# Altium schematic sheet Power.SchDoc
size 406 x 304 mm; SheetNumber: 2; SheetTotal: 6
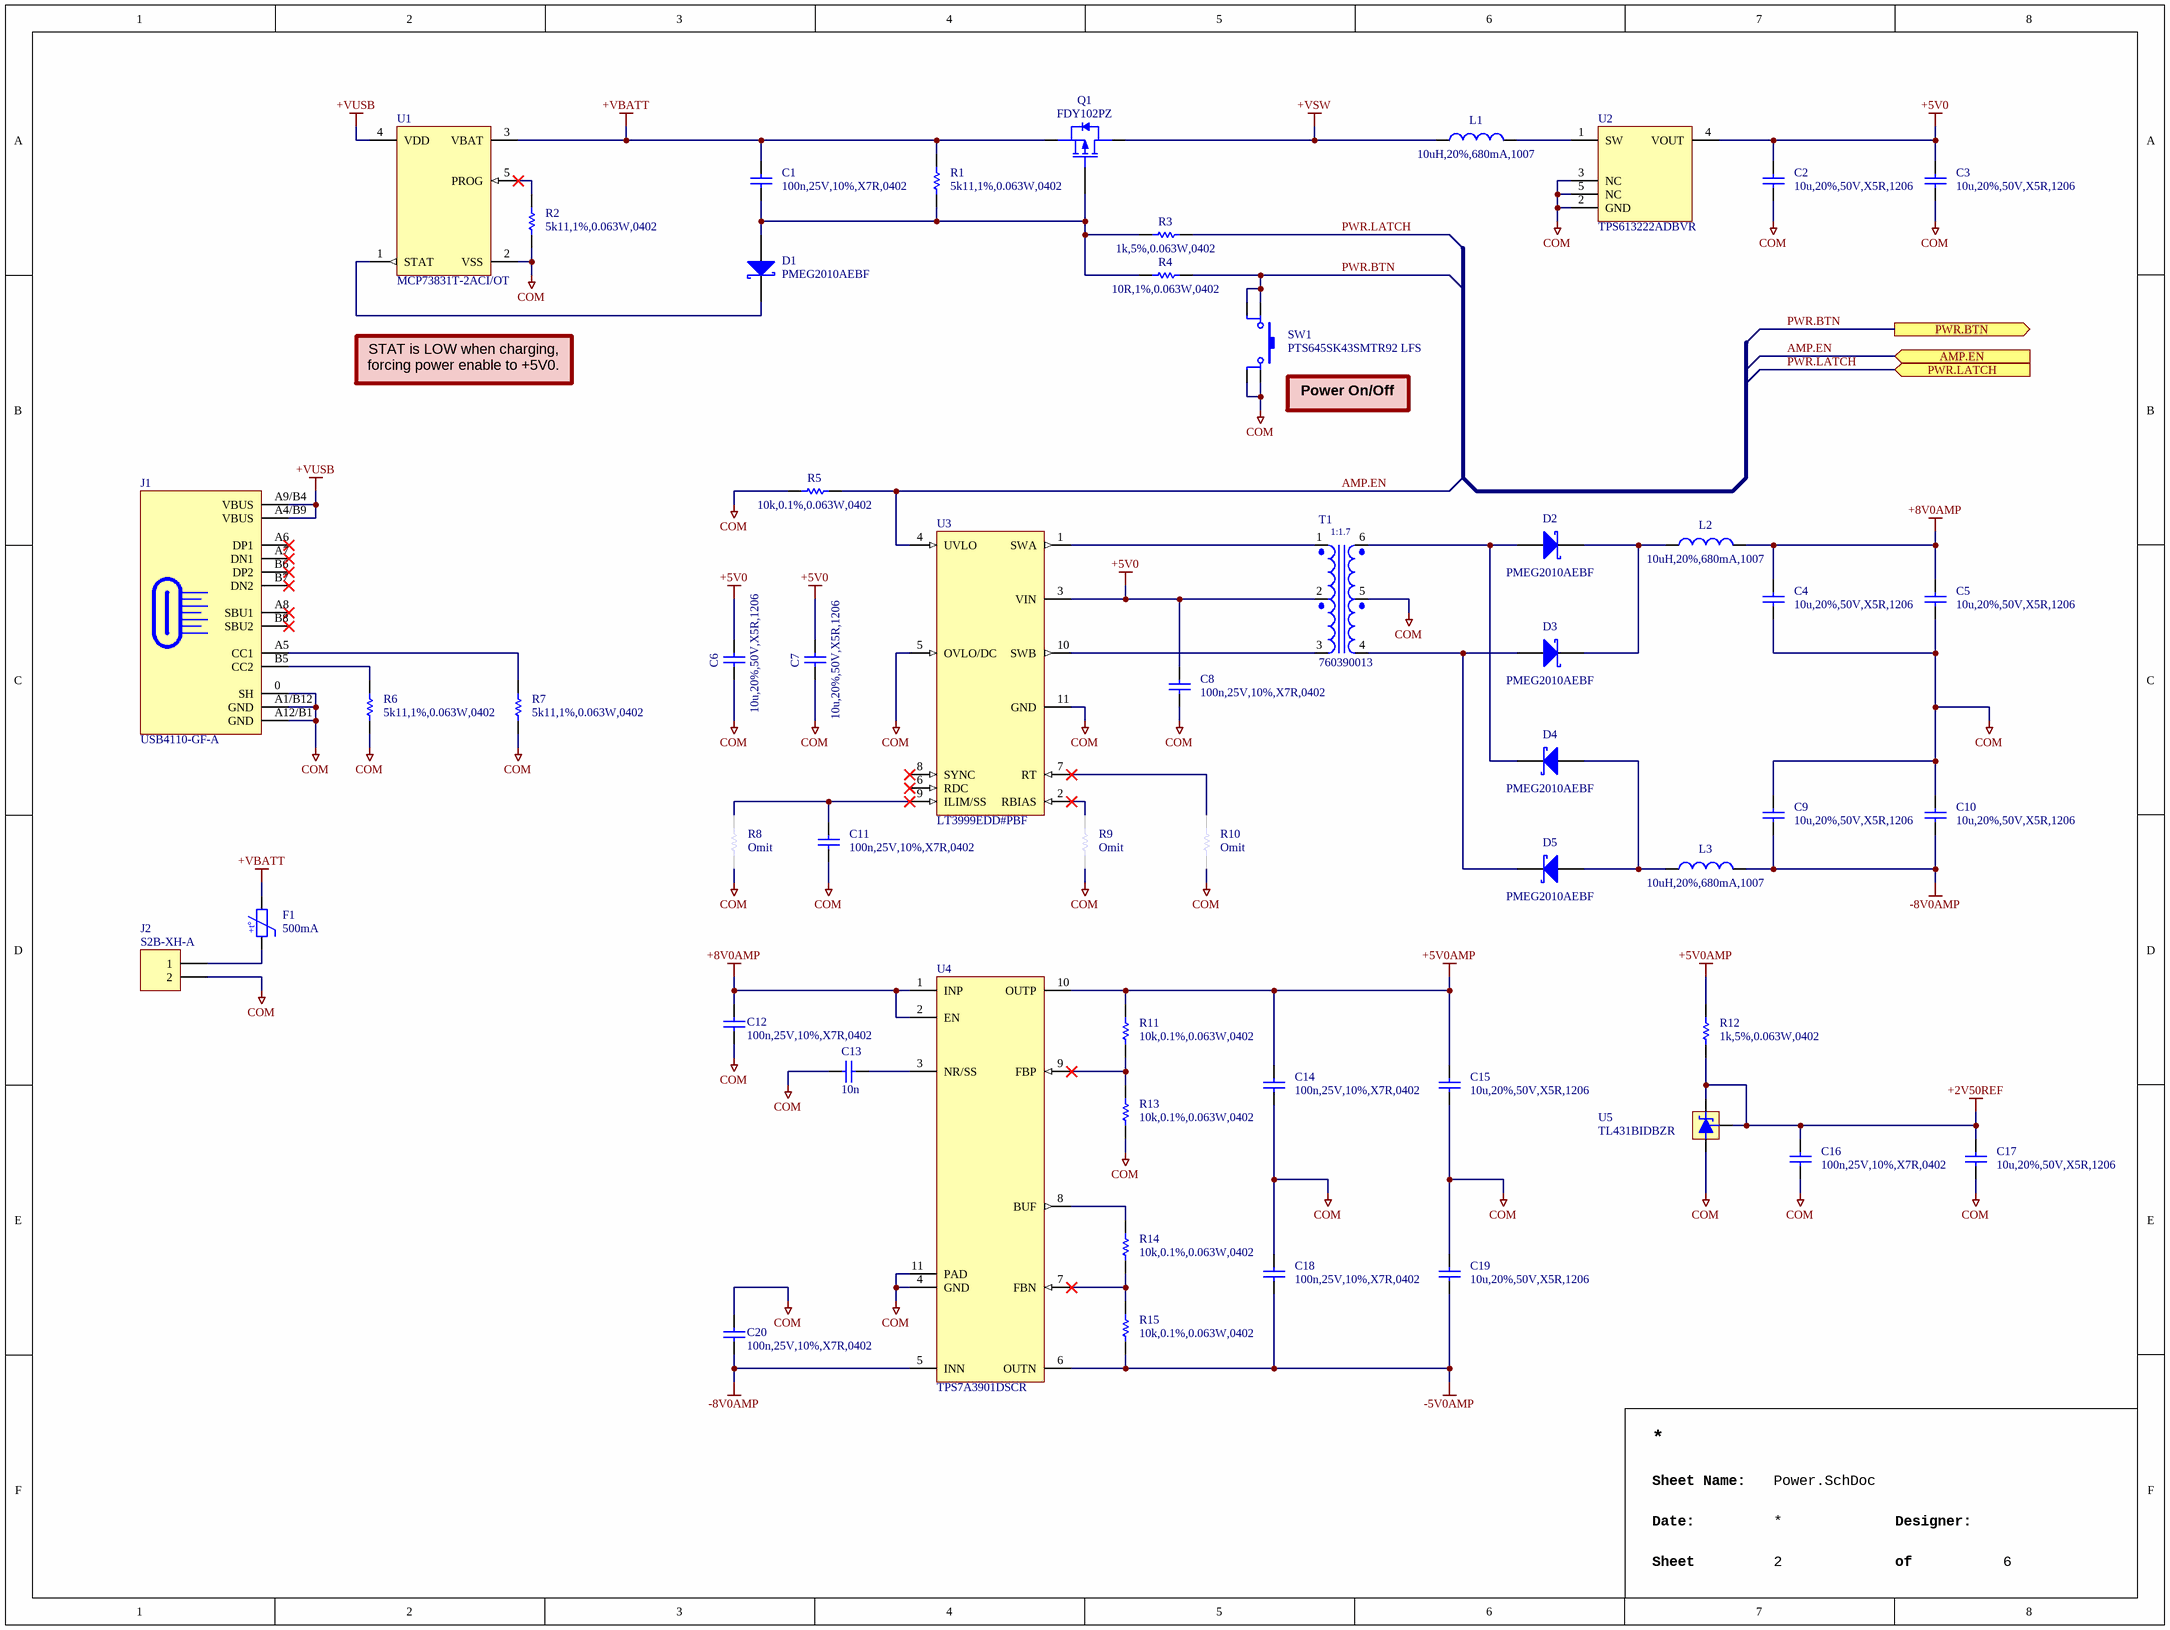
[diagram p0: Power.SchDoc]

## Parts
C1  100n,25V,10%,X7R,0402  [CAPC1005X06N]
C2  10u,20%,50V,X5R,1206  [CAPC3216X16N]
C3  10u,20%,50V,X5R,1206  [CAPC3216X16N]
C4  10u,20%,50V,X5R,1206  [CAPC3216X16N]
C5  10u,20%,50V,X5R,1206  [CAPC3216X16N]
C6  10u,20%,50V,X5R,1206  [CAPC3216X16N]
C7  10u,20%,50V,X5R,1206  [CAPC3216X16N]
C8  100n,25V,10%,X7R,0402  [CAPC1005X06N]
C9  10u,20%,50V,X5R,1206  [CAPC3216X16N]
C10  10u,20%,50V,X5R,1206  [CAPC3216X16N]
C11  100n,25V,10%,X7R,0402  [CAPC1005X06N]
C12  100n,25V,10%,X7R,0402  [CAPC1005X06N]
C13  10n  [CAPC1005X06N]
C14  100n,25V,10%,X7R,0402  [CAPC1005X06N]
C15  10u,20%,50V,X5R,1206  [CAPC3216X16N]
C16  100n,25V,10%,X7R,0402  [CAPC1005X06N]
C17  10u,20%,50V,X5R,1206  [CAPC3216X16N]
C18  100n,25V,10%,X7R,0402  [CAPC1005X06N]
C19  10u,20%,50V,X5R,1206  [CAPC3216X16N]
C20  100n,25V,10%,X7R,0402  [CAPC1005X06N]
D1  PMEG2010AEBF  [NEXPERIA_PKG_SOD523]
D2  PMEG2010AEBF  [NEXPERIA_PKG_SOD523]
D3  PMEG2010AEBF  [NEXPERIA_PKG_SOD523]
D4  PMEG2010AEBF  [NEXPERIA_PKG_SOD523]
D5  PMEG2010AEBF  [NEXPERIA_PKG_SOD523]
F1  500mA  [BELFUSE_CHIP1812]
J1  USB4110-GF-A  [GCT_USB4110-GF-A]
J2  S2B-XH-A  [JST_S2B-XH-A]
L1  10uH,20%,680mA,1007  [TAIYO-YUDEN_LSQPA251818T100M]
L2  10uH,20%,680mA,1007  [TAIYO-YUDEN_LSQPA251818T100M]
L3  10uH,20%,680mA,1007  [TAIYO-YUDEN_LSQPA251818T100M]
Q1  FDY102PZ  [ONSEMI_SC-89]
R1  5k11,1%,0.063W,0402  [RESC1005X04N]
R2  5k11,1%,0.063W,0402  [RESC1005X04N]
R3  1k,5%,0.063W,0402  [RESC1005X04N]
R4  10R,1%,0.063W,0402  [RESC1005X04N]
R5  10k,0.1%,0.063W,0402  [RESC1005X04N]
R6  5k11,1%,0.063W,0402  [RESC1005X04N]
R7  5k11,1%,0.063W,0402  [RESC1005X04N]
R8  Omit  [RESC1005X04N]  (no BOM)
R9  Omit  [RESC1005X04N]  (no BOM)
R10  Omit  [RESC1005X04N]  (no BOM)
R11  10k,0.1%,0.063W,0402  [RESC1005X04N]
R12  1k,5%,0.063W,0402  [RESC1005X04N]
R13  10k,0.1%,0.063W,0402  [RESC1005X04N]
R14  10k,0.1%,0.063W,0402  [RESC1005X04N]
R15  10k,0.1%,0.063W,0402  [RESC1005X04N]
SW1  PTS645SK43SMTR92 LFS  [C&K_PTS645SK43SMTR92 LFS]
T1  760390013  [WURTH_760390013]
U1  MCP73831T-2ACI/OT  [MICROCHIP_PKG_SOT23(C04-2091-OT)]
U2  TPS613222ADBVR  [TEXASINSTRUMENTS_PKG_DBV0005A]
U3  LT3999EDD#PBF  [ANALOGDEVICES_PKG_DD]
U4  TPS7A3901DSCR  [TEXASINSTRUMENTS_PKG_DSC0010J]
U5  TL431BIDBZR  [SOT95P240X120-3N]

## Ports
AMP.EN (in), PWR.BTN (out), PWR.LATCH (in)

## Nets
+2V50REF: C16.2 C17.2 R12.1 U5.1 U5.2
+5V0: C2.2 C3.2 C6.2 C7.2 C8.2 T1.2(PCT) U2.4(VOUT) U3.3(VIN)
+5V0AMP: C14.2 C15.2 R11.2 R12.2 U4.10(OUTP)
+8V0AMP: C4.2 C5.2 C12.2 L2.2 U4.1(INP) U4.2(EN)
+VBATT: C1.2 F1.2 Q1.2(S) R1.2 U1.3(VBAT)
+VSW: L1.1 Q1.3(D)
+VUSB: J1.A4/B9(VBUS) J1.A9/B4(VBUS) U1.4(VDD)
-5V0AMP: C18.1 C19.1 R15.1 U4.6(OUTN)
-8V0AMP: C9.1 C10.1 C20.1 L3.2 U4.5(INN)
COM: C2.1 C3.1 C4.1 C5.1 C6.1 C7.1 C8.1 C9.2 C10.2 C11.1 C12.1 C13.2 C14.1 C15.1 C16.1 C17.1 C18.2 C19.2 C20.2 J1.0(SH) J1.A1/B12(GND) J1.A12/B1(GND) J2.2 R2.1 R5.1 R6.1 R7.1 R8.1 R9.1 R10.1 R13.1 SW1.3 SW1.4 T1.5(SCT) U1.2(VSS) U2.2(GND) U2.3(NC) U2.5(NC) U3.5(OVLO/DC) U3.11(GND) U4.4(GND) U4.11(PAD) U5.3
AMP.EN: R5.2 U3.4(UVLO) ; port AMP.EN
PWR.BTN: R4.2 SW1.1 SW1.2 ; port PWR.BTN
PWR.LATCH: R3.1 ; port PWR.LATCH
NetC1_1: C1.1 D1.2(A) Q1.1(G) R1.1 R3.2 R4.1
NetC11_2: C11.2 R8.2 U3.9(ILIM/SS)
NetC13_1: C13.1 U4.3(NR/SS)
NetD1_1: D1.1(K) U1.1(STAT)
NetD2_1: D2.1(K) D3.1(K) L2.1
NetD2_2: D2.2(A) D4.1(K) T1.6(S+)
NetD3_2: D3.2(A) D5.1(K) T1.4(S-)
NetD4_2: D4.2(A) D5.2(A) L3.1
NetF1_1: F1.1 J2.1
NetJ1_A5: J1.A5(CC1) R7.2
NetJ1_B5: J1.B5(CC2) R6.2
NetL1_2: L1.2 U2.1(SW)
NetR2_2: R2.2 U1.5(PROG)
NetR9_2: R9.2 U3.2(RBIAS)
NetR10_2: R10.2 U3.7(RT)
NetR11_1: R11.1 R13.2 U4.9(FBP)
NetR14_1: R14.1 R15.2 U4.7(FBN)
NetR14_2: R14.2 U4.8(BUF)
NetT1_1: T1.1(P+) U3.1(SWA)
NetT1_3: T1.3(P-) U3.10(SWB)

Not connected (* = marked no-connect by the designer): J1 A6(DP1)* A7(DN1)* A8(SBU1)* B6(DP2)* B7(DN2)* B8(SBU2)*; U3 6(RDC)* 8(SYNC)*

## Notes on the sheet
- STAT is LOW when charging, forcing power enable to +5V0.
- (near SW1) Power On/Off
- Sheet Name:
- Date:
- Sheet
- Designer:
- of
- (in symbol PTC,30V,500mA,1812) +t°
- (in symbol XFR,1-1.7,Lp=475uH,760390013) 1:1.7

## Library data of the parts
C1 C8 C11 C12 C14 C16 C18 C20 = CAP,Cer,100nF,10%,25VDC,X7R,0402: 0.1ï¿½F ï¿½10% 25V Ceramic Capacitor X7R 0402 (1005 Metric); Manufacturer 1: Murata Electronics; Manufacturer 1 Part Number: GRM155R71E104KE14J; Vendor 1 Part Number: 490-14603-1-ND; Vendor 1: DigiKey; Value: 100nF; Part Name: CAP,Cer,100nF,10%,25VDC,X7R,0402; CreatedBy: Judd Foster; HelpURL: https://search.murata.co.jp/Ceramy/image/img/A01X/G101/ENG/GRM155R71E104KE14-01.pdf
C2-C7 C9 C10 C15 C17 C19 = CAP,Cer,10uF,50VDC,X5R,1206: 10ï¿½F ï¿½20% 50V Ceramic Capacitor X5R 1206 (3216 Metric); Manufacturer 1: Samsung Electro-Mechanics; Manufacturer 1 Part Number: CL31A106MBHNNNE; Vendor 1 Part Number: 1276-6736-1-ND; Vendor 1: Digikey; Part Name: CAP,Cer,10uF,50VDC,X5R,1206; CreatedBy: Judd Foster; HelpURL: https://www.samsungsem.com/resources/file/global/support/product_catalog/MLCC.pdf; Value: 10u
C13 = CAP,Cer,10nF,25VDC,X7R,0402: 10000pF ï¿½10% 25V Ceramic Capacitor X7R 0402 (1005 Metric); Manufacturer 1: Murata Electronics; Manufacturer 1 Part Number: GCM155R71E103KA37D; Vendor 1 Part Number: 490-6043-1-ND; Vendor 1: Digikey; Part Name: CAP,Cer,10nF,25VDC,X7R,0402; CreatedBy: Judd Foster; HelpURL: https://psearch.en.murata.com/capacitor/product/GCM155R71E103KA37%23.pdf; Value: 10n
D1-D5 = DIODE,Schottky,20V,1A,SOD523: Diode 20 V 1A Surface Mount SOD-523; Manufacturer 1: Nexperia USA Inc.; Vendor 1 Part Number: 1727-8539-1-ND; Vendor 1: DigiKey; Part Name: DIODE,Schottky,20V,1A,SOD523; CreatedBy: Judd Foster; HelpURL: https://assets.nexperia.com/documents/data-sheet/PMEG2010AEB.pdf; Manufacturer 1 Part Number: PMEG2010AEBF
F1 = PTC,30V,500mA,1812: Polymeric PTC Resettable Fuse 30V 500 mA Ih Surface Mount 1812 (4532 Metric), Concave; Manufacturer 1: Bel Fuse Inc.; Manufacturer 1 Part Number: 0ZCG0050AF2C; Vendor 1 Part Number: 507-1762-1-ND; Vendor 1: Digikey; Part Name: PTC,30V,500mA,1812; CreatedBy: Judd Foster; HelpURL: https://www.belfuse.com/resources/datasheets/circuitprotection/ds-cp-0zcg-series.pdf; Value: 500mA
J1 = Conn,USB_C,SMD: USB-C (USB TYPE-C) USB 2.0 Receptacle Connector 24 (16+8 Dummy) Position Surface Mount, Right Angle; Manufacturer 1: GCT; Vendor 1 Part Number: 2073-USB4110-GF-A-1-ND; Vendor 1: Digikey; Part Name: Conn,USB_C,SMD; CreatedBy: Judd Foster; HelpURL: https://gct.co/files/drawings/usb4110.pdf; Manufacturer 1 Part Number: USB4110-GF-A
J2 = Conn,JST,2Pin,2.5mm,RA,Thru: Connector Header Through Hole, Right Angle 2 position 0.098" (2.50mm); Manufacturer 1: JST Sales America Inc.; Vendor 1 Part Number: 455-S2B-XH-A-ND; Vendor 1: DigiKey; Part Name: Conn,JST,2Pin,2.5mm,RA,Thru; CreatedBy: Judd Foster; HelpURL: https://www.jst-mfg.com/product/pdf/eng/eXH.pdf; Manufacturer 1 Part Number: S2B-XH-A
L1-L3 = IND,10uH,680mA,Wirewound,1007: 10 ÂµH Unshielded Wirewound Inductor 680 mA 468mOhm Max 1007 (2518 Metric); Manufacturer 1: Taiyo Yuden; Manufacturer 1 Part Number: LSQPA251818T100M; Vendor 1 Part Number: 587-LSQPA251818T100MCT-ND; Vendor 1: Digikey; Part Name: IND,10uH,680mA,Wirewound,1007; CreatedBy: Judd Foster; HelpURL: https://mm.digikey.com/Volume0/opasdata/d220001/medias/docus/6025/LSQPA251818T100M_SS.pdf; Value: 10uH
Q1 = MOSFET,P Ch,20V,830mA: P-Channel 20 V 830mA (Ta) 625mW (Ta) Surface Mount SC-89-3; Manufacturer 1: onsemi; Vendor 1 Part Number: FDY102PZCT-ND; Vendor 1: Digikey; Part Name: MOSFET,P Ch,20V,830mA; CreatedBy: Judd Foster; HelpURL: https://rocelec.widen.net/view/pdf/hh954mlmw6/FAIR-S-A0000083184-1.pdf?t.download=true&u=5oefqw; Manufacturer 1 Part Number: FDY102PZ
R1 R2 R6 R7 = RES,5k11,1%,0.063W,0402: 5.11 kOhms ï¿½1% 0.063W, 1/16W Chip Resistor 0402 (1005 Metric) Automotive AEC-Q200, Moisture Resistant Thick Film; Manufacturer 1: Yageo; Manufacturer 1 Part Number: AC0402FR-075K11L; Vendor 1 Part Number: 13-AC0402FR-075K11LCT-ND; Vendor 1: Digikey; Part Name: RES,5k11,1%,0.063W,0402; CreatedBy: Judd Foster; HelpURL: https://www.yageo.com/upload/media/product/productsearch/datasheet/rchip/PYu-AC_51_RoHS_L_7.pdf; Value: 5k11
R3 R12 = RES,1k,5%,0.063W,0402: 1 kOhms ï¿½5% 0.063W, 1/16W Chip Resistor 0402 (1005 Metric) Automotive AEC-Q200 Thick Film; Manufacturer 1: Stackpole Electronics Inc; Manufacturer 1 Part Number: RMCF0402JT1K00; Vendor 1 Part Number: RMCF0402JT1K00CT-ND; Vendor 1: DIgikey; Part Name: RES,1k,5%,0.063W,0402; CreatedBy: Judd Foster; HelpURL: https://www.seielect.com/catalog/sei-rmcf_rmcp.pdf; Value: 1k
R4 = RES,10R,1%,0.063W,0402: 10 Ohms ï¿½1% 0.063W, 1/16W Chip Resistor 0402 (1005 Metric) Automotive AEC-Q200 Thick Film; Manufacturer 1: Panasonic Electronic Components; Manufacturer 1 Part Number: ERJ-2RKF10R0X; Vendor 1 Part Number: P10.0LCT-ND; Vendor 1: Digikey; Part Name: RES,10R,1%,0.063W,0402; CreatedBy: Judd Foster; HelpURL: https://industrial.panasonic.com/cdbs/www-data/pdf/RDA0000/AOA0000C304.pdf; Value: 10R
R5 R11 R13-R15 = RES,10k,0.1%,0.063W,0402: 10 kOhms ï¿½0.1% 0.1W, 1/10W Chip Resistor 0402 (1005 Metric) Automotive AEC-Q200 Thin Film; Manufacturer 1: Stackpole Electronics Inc; Manufacturer 1 Part Number: RNCF0402BTE10K0; Vendor 1 Part Number: RNCF0402BTE10K0CT-ND; Vendor 1: Digikey; Part Name: RES,10k,0.1%,0.063W,0402; CreatedBy: Judd Foster; HelpURL: https://www.seielect.com/catalog/sei-rncf.pdf; Value: 10k
R8-R10 = RES,Omit,0402: Part Name: RES,Omit,0402; CreatedBy: Judd Foster; HelpURL: N/A; Manufacturer 1: N/A; Manufacturer 1 Part Number: N/A; Vendor 1: N/A; Vendor 1 Part Number: N/A; Value: Omit
SW1 = Switch,Tactile,SPST-NO,SMD,H4.3: Tactile Switch SPST-NO Top Actuated Surface Mount; Manufacturer 1: C&K; Vendor 1 Part Number: CKN9084CT-ND; Vendor 1: Digikey; Part Name: Switch,Tactile,SPST-NO,SMD,H4.3; CreatedBy: Judd Foster; HelpURL: https://www.ckswitches.com/media/1471/pts645.pdf; Manufacturer 1 Part Number: PTS645SK43SMTR92 LFS
T1 = XFR,1-1.7,Lp=475uH,760390013: Forward, Push-Pull Converters For For DC/DC Converters SMPS Transformer 3125Vrms Isolation 10kHz Surface Mount; Manufacturer 1: WÃ¼rth Elektronik; Vendor 1 Part Number: 732-4457-1-ND; Vendor 1: DigiKey; Part Name: XFR,1-1.7,Lp=475uH,760390013; CreatedBy: Judd Foster; HelpURL: https://www.we-online.com/components/products/datasheet/760390013.pdf; Manufacturer 1 Part Number: 760390013
U1 = MCP73831T-2ACI_OT: Charger IC Lithium Ion/Polymer SOT-23-5; Manufacturer 1: Microchip Technology; Vendor 1 Part Number: MCP73831T-2ACI/OTCT-ND; Vendor 1: DigiKey; Part Name: MCP73831T-2ACI_OT; CreatedBy: Judd Foster; HelpURL: https://ww1.microchip.com/downloads/en/DeviceDoc/MCP73831-Family-Data-Sheet-DS20001984H.pdf; Manufacturer 1 Part Number: MCP73831T-2ACI/OT
U2 = TPS613222ADBVR: Boost Switching Regulator IC Positive Fixed 5V 1 Output 2.5A (Switch) SC-74A, SOT-753; Manufacturer 1: Texas Instruments; Vendor 1 Part Number: 296-50503-1-ND; Vendor 1: DigiKey; Part Name: TPS613222ADBVR; CreatedBy: Judd Foster; HelpURL: https://www.ti.com/lit/ds/symlink/tps61322.pdf?HQS=dis-dk-null-digikeymode-dsf-pf-null-wwe&ts=1737253084273; Manufacturer 1 Part Number: TPS613222ADBVR
U3 = LT3999EDD#PBF: Push-Pull Switching Regulator IC Positive, Isolation Capable Adjustable 1 Output 1A 10-WFDFN Exposed Pad; Manufacturer 1: Analog Devices Inc.; Vendor 1 Part Number: 505-LT3999EDD#PBF-ND; Vendor 1: DigiKey; Part Name: LT3999EDD#PBF; CreatedBy: Judd Foster; HelpURL: https://www.analog.com/media/en/technical-documentation/data-sheets/3999fa.pdf; Manufacturer 1 Part Number: LT3999EDD#PBF
U4 = TPS7A3901DSCR: Linear Voltage Regulator IC Positive and Negative Adjustable 2 Output 150mA 10-WSON (3x3); Manufacturer 1: Texas Instruments; Vendor 1 Part Number: 296-TPS7A3901DSCRCT-ND; Vendor 1: DigiKey; Part Name: TPS7A3901DSCR; CreatedBy: Judd Fosterr; HelpURL: https://www.ti.com/lit/ds/symlink/tps7a39.pdf?HQS=dis-dk-null-digikeymode-dsf-pf-null-wwe&ts=1737244835193&ref_url=https%253A%252F%252Fwww.ti.com%252Fgeneral%252Fdocs%252Fsuppproductinfo.tsp%253FdistId%253D10%2526gotoUrl%253Dhttps%253A%252F%252Fwww.ti.com; Manufacturer 1 Part Number: TPS7A3901DSCR
U5 = TL431BIDBZR: IC VREF SHUNT 36V 0.5% SOT23-3; Manufacturer 1: Texas Instruments; Vendor 1 Part Number: 296-18872-1-ND; Vendor 1: Digikey; Part Name: TL431BIDBZR; CreatedBy: Judd Foster; HelpURL: http://www.ti.com/lit/ds/symlink/tl431.pdf; Manufacturer 1 Part Number: TL431BIDBZR